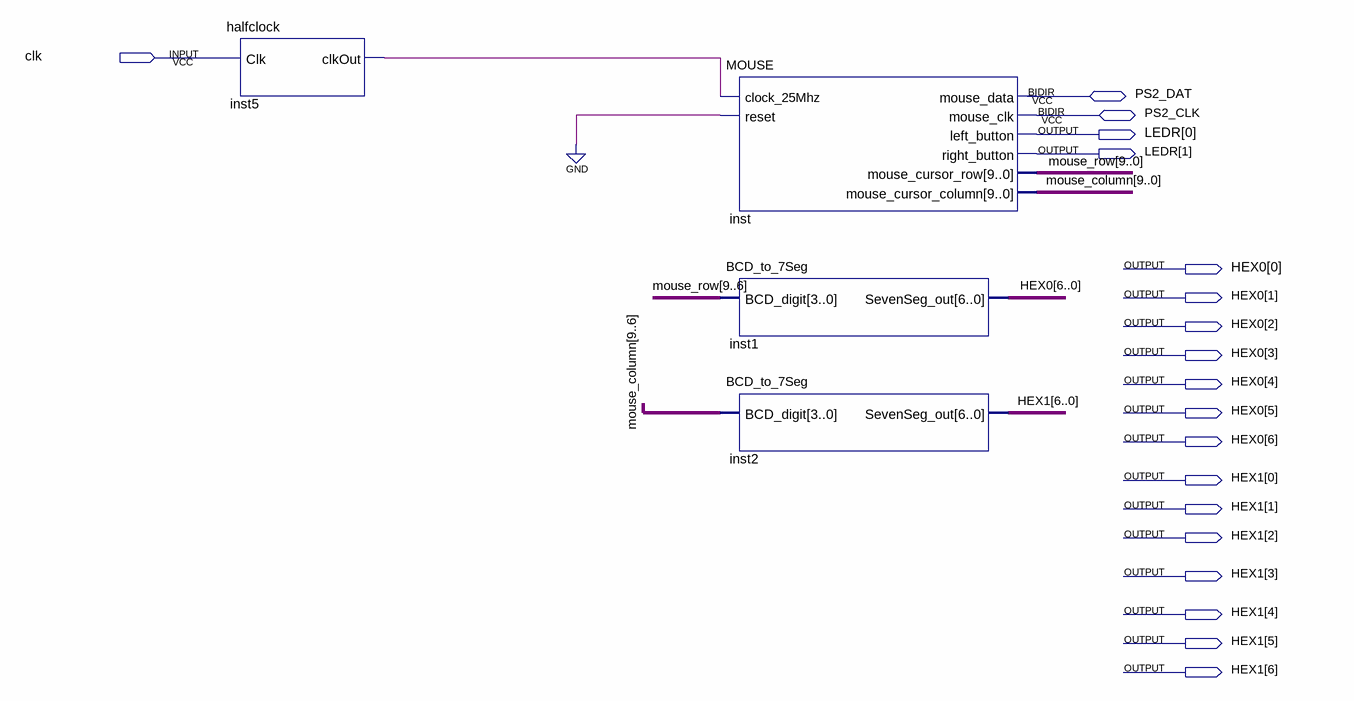
[diagram p0: schematic sheet]
// Quartus schematic MiniProjectQuartus.bdf as structural Verilog: 4 symbols, 19 pins
module MiniProjectQuartus (
  input  clk,
  inout  PS2_DAT,
  inout  PS2_CLK,
  output [1:0] LEDR,
  output [6:0] HEX0,
  output [6:0] HEX1
);

  wire inst5_clkout;
  wire [9:0] mouse_column, mouse_row;

  halfclock inst5 (.Clk(clk), .clkOut(inst5_clkout));
  MOUSE inst (
    .clock_25Mhz(inst5_clkout), .reset(1'b0), .left_button(LEDR[0]), .right_button(LEDR[1]),
    .mouse_cursor_row(mouse_row), .mouse_cursor_column(mouse_column), .mouse_data(PS2_DAT),
    .mouse_clk(PS2_CLK));
  BCD_to_7Seg inst1 (.BCD_digit(mouse_row[9:6]), .SevenSeg_out(HEX0));
  BCD_to_7Seg inst2 (.BCD_digit(mouse_column[9:6]), .SevenSeg_out(HEX1));
endmodule
